# Altium schematic sheet Sheet1.SchDoc
size A4; SheetNumber: 1; SheetTotal: 6
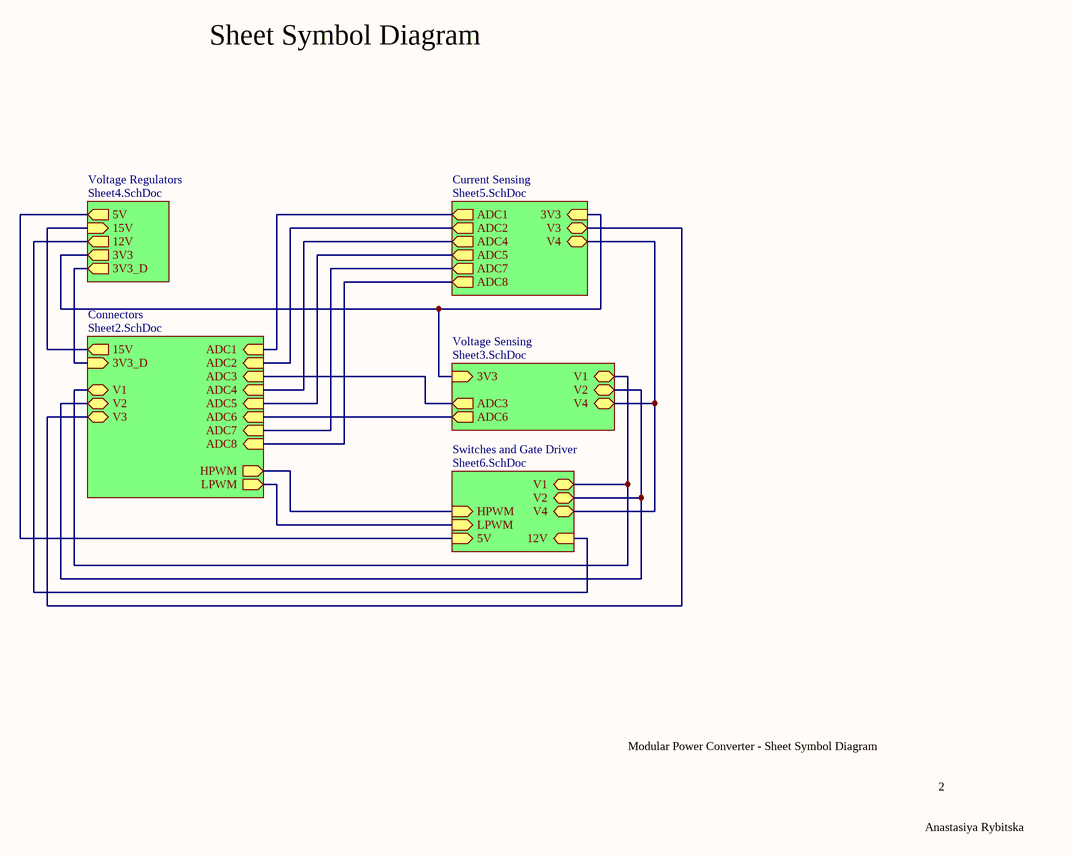
[diagram p0: Sheet1.SchDoc]

## Sub-sheets
Connectors = Sheet2.SchDoc: V1 (bidir), V2 (bidir), V3 (bidir), 15V (out), 3V3_D (in), ADC1 (in), ADC2 (in), ADC3 (in), ADC4 (in), ADC5 (in), ADC6 (in), ADC7 (in), ADC8 (in), HPWM (out), LPWM (out)
Current Sensing = Sheet5.SchDoc: V4 (bidir), V3 (bidir), ADC8 (out), ADC7 (out), ADC5 (out), ADC4 (out), ADC2 (out), ADC1 (out), 3V3 (in)
Switches and Gate Driver = Sheet6.SchDoc: V4 (bidir), V2 (bidir), 12V (in), HPWM (in), LPWM (in), V1 (bidir), 5V (in)
Voltage Regulators = Sheet4.SchDoc: 15V (in), 12V (out), 3V3 (out), 3V3_D (out), 5V (out)
Voltage Sensing = Sheet3.SchDoc: 3V3 (in), ADC3 (out), ADC6 (out), V1 (bidir), V2 (bidir), V4 (bidir)

## Nets
(unnamed): sheet Connectors/V1, sheet Voltage Sensing/V1, sheet Switches and Gate Driver/V1
(unnamed): sheet Connectors/V2, sheet Voltage Sensing/V2, sheet Switches and Gate Driver/V2
(unnamed): sheet Connectors/V3, sheet Current Sensing/V3
(unnamed): sheet Connectors/15V, sheet Voltage Regulators/15V
(unnamed): sheet Connectors/3V3_D, sheet Voltage Regulators/3V3_D
(unnamed): sheet Connectors/ADC1, sheet Current Sensing/ADC1
(unnamed): sheet Connectors/ADC2, sheet Current Sensing/ADC2
(unnamed): sheet Connectors/ADC3, sheet Voltage Sensing/ADC3
(unnamed): sheet Connectors/ADC4, sheet Current Sensing/ADC4
(unnamed): sheet Connectors/ADC5, sheet Current Sensing/ADC5
(unnamed): sheet Connectors/ADC6, sheet Voltage Sensing/ADC6
(unnamed): sheet Connectors/ADC7, sheet Current Sensing/ADC7
(unnamed): sheet Connectors/ADC8, sheet Current Sensing/ADC8
(unnamed): sheet Connectors/HPWM, sheet Switches and Gate Driver/HPWM
(unnamed): sheet Connectors/LPWM, sheet Switches and Gate Driver/LPWM
(unnamed): sheet Voltage Sensing/3V3, sheet Voltage Regulators/3V3, sheet Current Sensing/3V3
(unnamed): sheet Voltage Sensing/V4, sheet Current Sensing/V4, sheet Switches and Gate Driver/V4
(unnamed): sheet Voltage Regulators/12V, sheet Switches and Gate Driver/12V
(unnamed): sheet Voltage Regulators/5V, sheet Switches and Gate Driver/5V

## Notes on the sheet
- Sheet Symbol Diagram
- Modular Power Converter - Sheet Symbol Diagram
- 2
- Anastasiya Rybitska